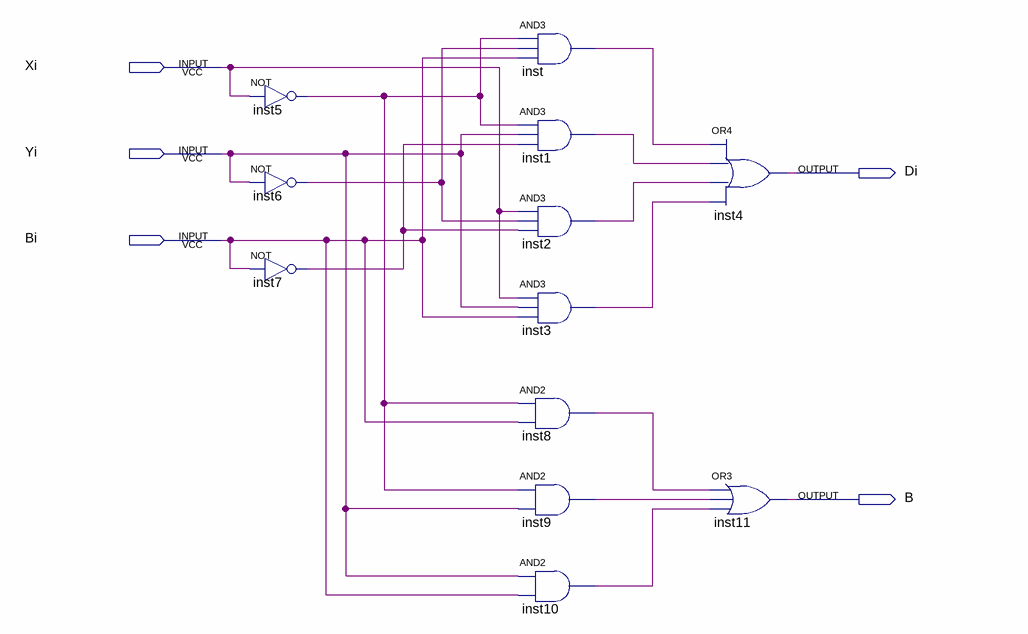
[diagram p0: schematic sheet]
// Quartus schematic FullSubstractor.bdf as structural Verilog: 12 symbols, 5 pins
module FullSubstractor (
  input  Xi,
  input  Yi,
  input  Bi,
  output Di,
  output B
);

  wire inst1_out, inst2_out, inst3_out, inst5_out, inst6_out, inst7_out, inst8_out, inst9_out, inst10_out,
       inst_out;

  not inst5 (inst5_out, Xi);
  not inst6 (inst6_out, Yi);
  not inst7 (inst7_out, Bi);
  and inst (inst_out, inst5_out, inst6_out, Bi);
  and inst1 (inst1_out, inst5_out, Yi, inst7_out);
  and inst2 (inst2_out, Xi, inst6_out, inst7_out);
  and inst3 (inst3_out, Xi, Yi, Bi);
  and inst8 (inst8_out, inst5_out, Bi);
  and inst9 (inst9_out, inst5_out, Yi);
  and inst10 (inst10_out, Yi, Bi);
  or inst4 (Di, inst_out, inst1_out, inst2_out, inst3_out);
  or inst11 (B, inst8_out, inst9_out, inst10_out);
endmodule
